# Altium schematic sheet PowerModule.SchDoc
size A3; SheetNumber: 1; SheetTotal: 8
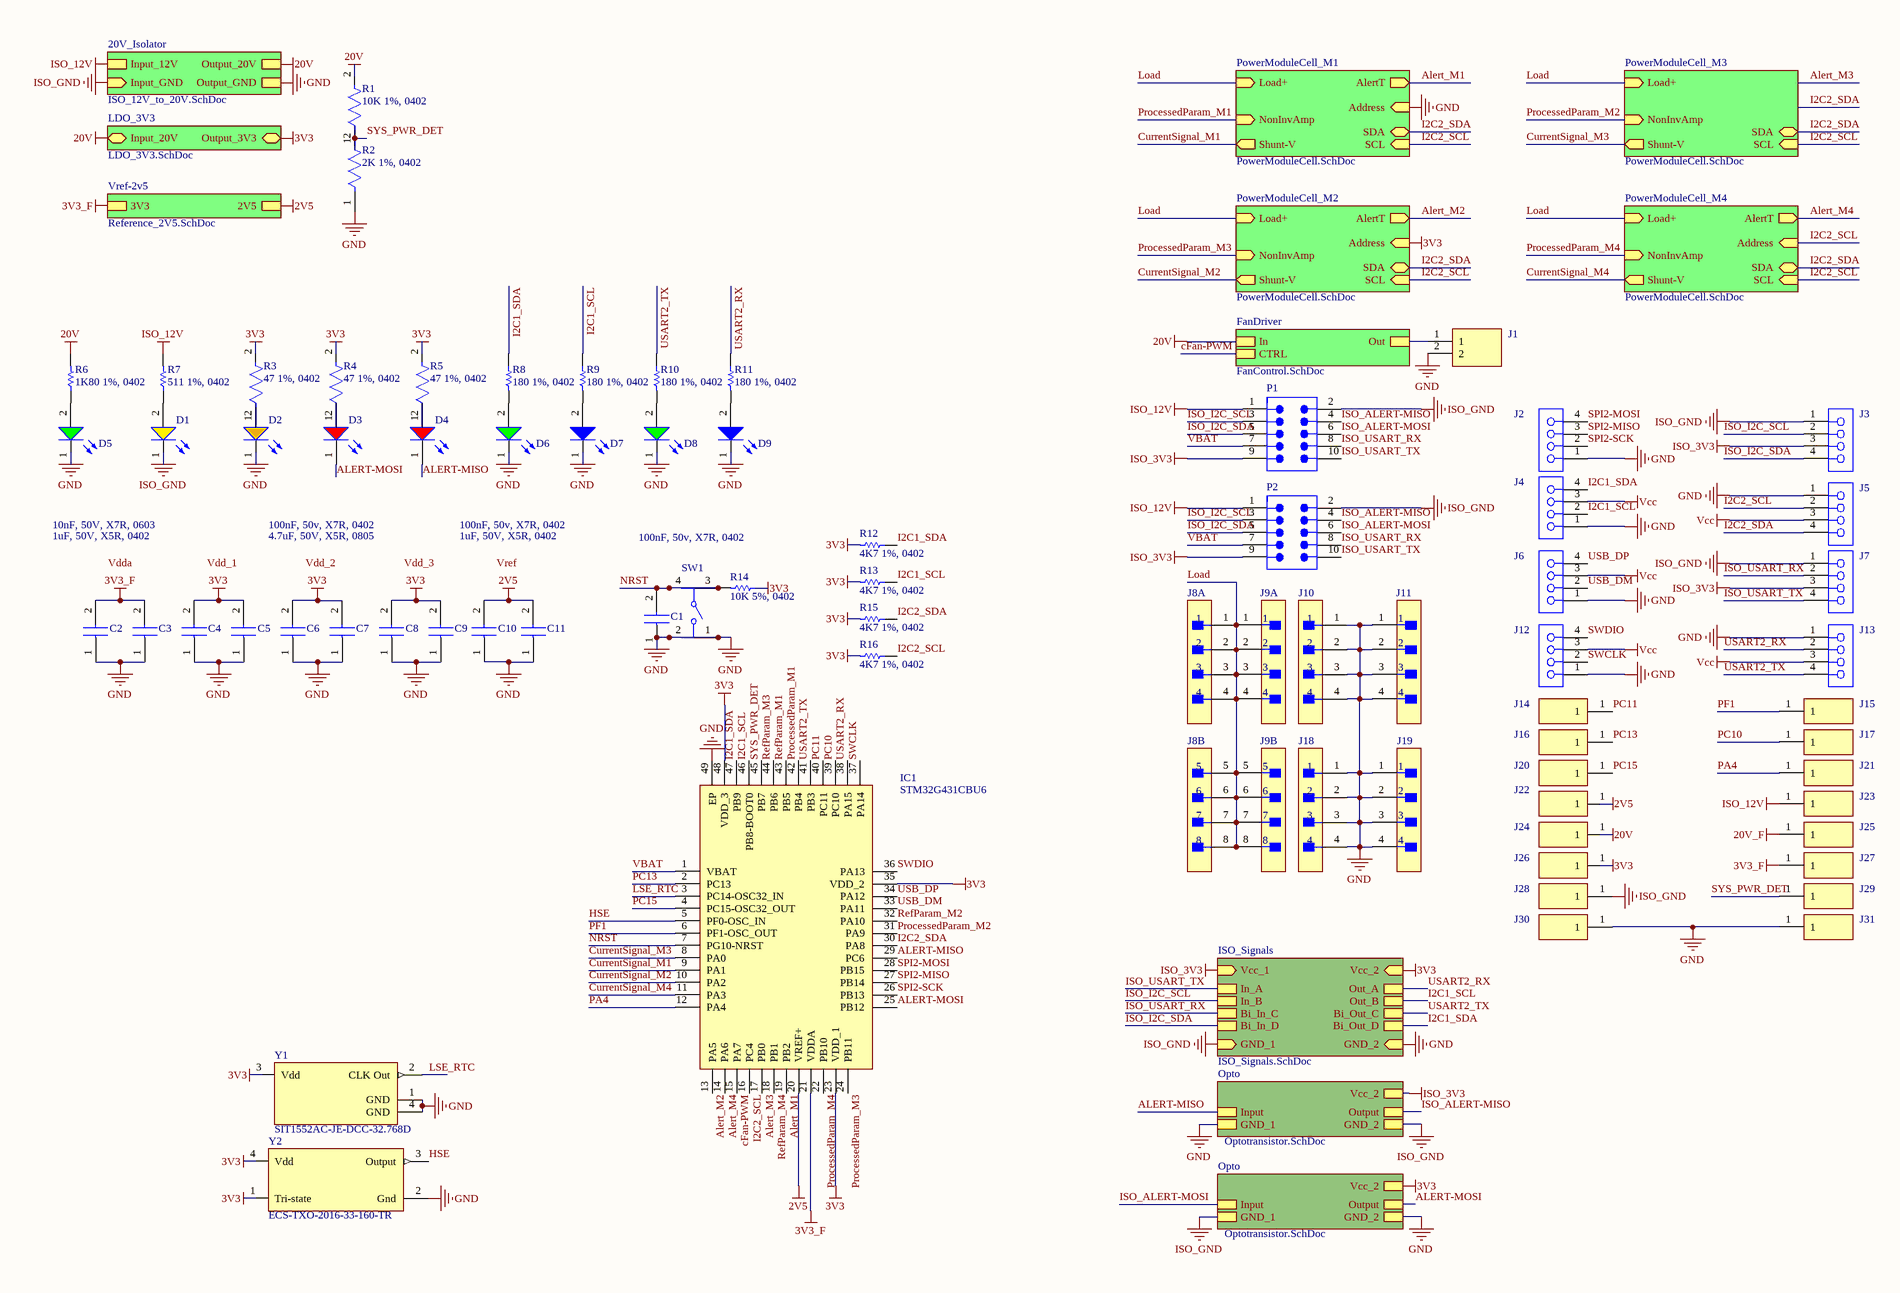
[diagram p0: PowerModule.SchDoc, left]
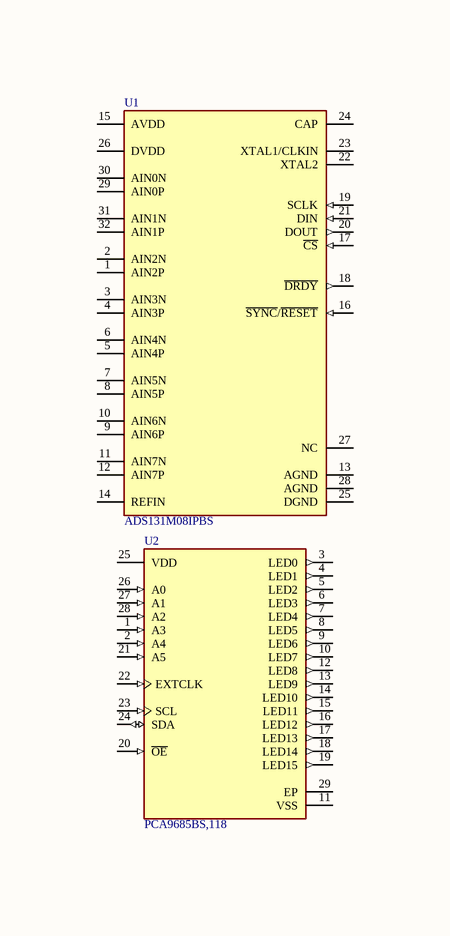
[diagram p1: PowerModule.SchDoc, middle]
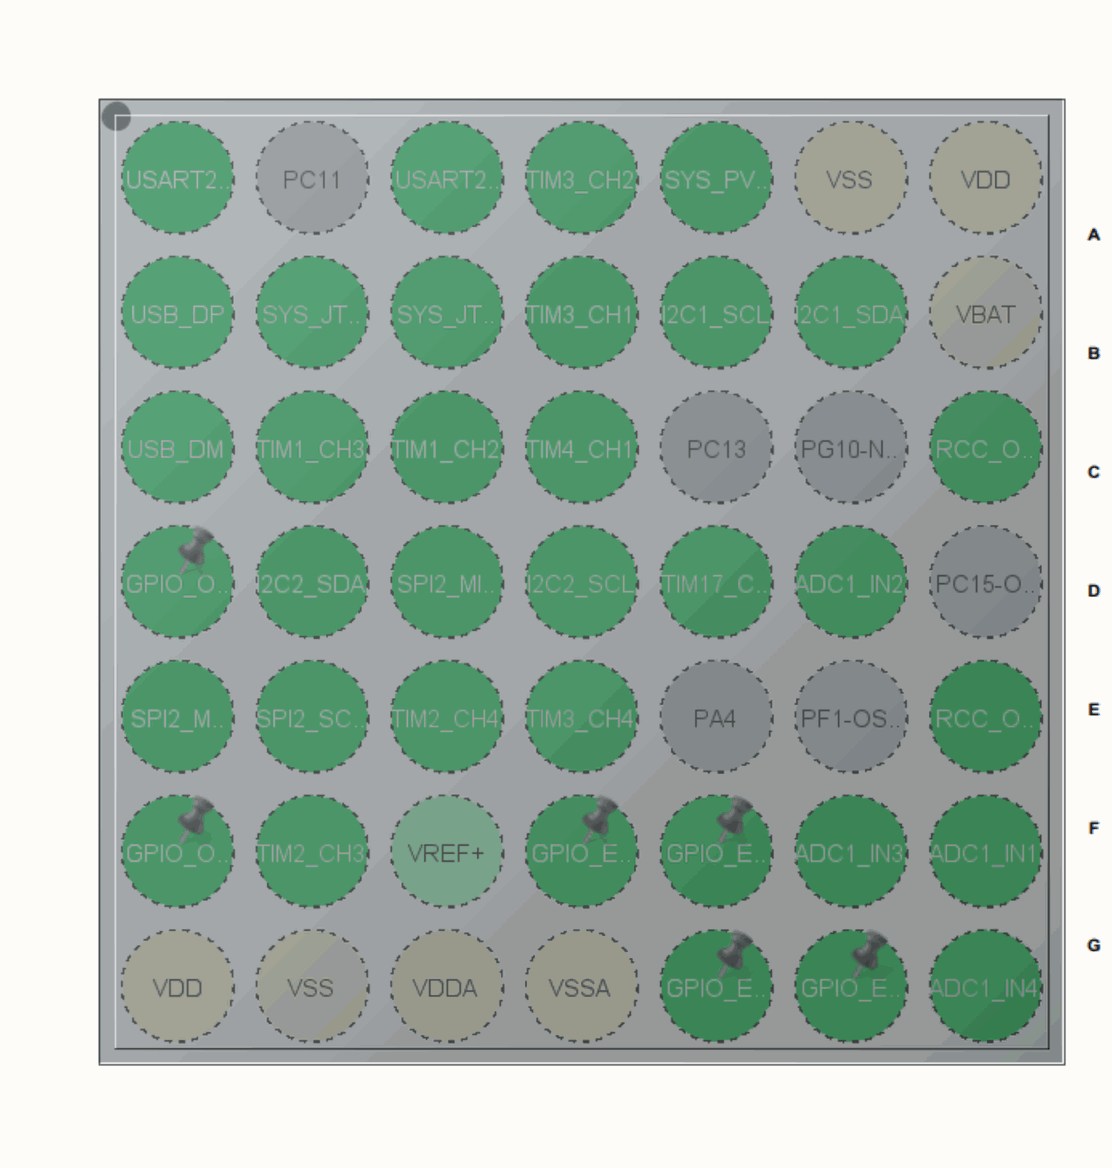
[diagram p2: PowerModule.SchDoc, right]

## Parts
C1  100nF, 50v, X7R, 0402  [CAPC2012X88N]  (value not drawn)
C2  10nF, 50V, X7R, 0603  [CAPC1608X87N]  (value not drawn)
C3  1uF, 50V, X5R, 0402  [GRM15x]  (value not drawn)
C4  100nF, 50v, X7R, 0402  [CAPC2012X88N]  (value not drawn)
C5  4.7uF, 50V, X5R, 0805  [CAPC2012X145N]  (value not drawn)
C6  100nF, 50v, X7R, 0402  [CAPC2012X88N]  (value not drawn)
C7  4.7uF, 50V, X5R, 0805  [CAPC2012X145N]  (value not drawn)
C8  100nF, 50v, X7R, 0402  [CAPC2012X88N]  (value not drawn)
C9  4.7uF, 50V, X5R, 0805  [CAPC2012X145N]  (value not drawn)
C10  100nF, 50v, X7R, 0402  [CAPC2012X88N]  (value not drawn)
C11  1uF, 50V, X5R, 0402  [GRM15x]  (value not drawn)
D1  150060YS75000  [WL-SMCW_0603_150060xx75000]  (value not drawn)
D2  150060AS75000  [WL-SMCW_0603_150060xx75000]  (value not drawn)
D3  150060RS75000  [WL-SMCW_0603_150060xx75000]  (value not drawn)
D4  150060RS75000  [WL-SMCW_0603_150060xx75000]  (value not drawn)
D5  150060GS75000  [WL-SMCW_0603_150060xx75000]  (value not drawn)
D6  150060GS75000  [WL-SMCW_0603_150060xx75000]  (value not drawn)
D7  150060BS75000  [WL-SMCW_0603_150060xx75000]  (value not drawn)
D8  150060GS75000  [WL-SMCW_0603_150060xx75000]  (value not drawn)
D9  150060BS75000  [WL-SMCW_0603_150060xx75000]  (value not drawn)
IC1  STM32G431CBU6  [QFN50P700X700X65-49N-D]
J1  1725656  [1725656]  (value not drawn)
J2  61300411821  [61300411821]  (value not drawn)  (net tie, no BOM)
J3  61300411821  [61300411821]  (value not drawn)  (net tie, no BOM)
J4  61300411821  [61300411821]  (value not drawn)  (net tie, no BOM)
J5  61300411821  [61300411821]  (value not drawn)  (net tie, no BOM)
J6  61300411821  [61300411821]  (value not drawn)  (net tie, no BOM)
J7  61300411821  [61300411821]  (value not drawn)  (net tie, no BOM)
J8  43045-0802  [FP-43045-0802-MFG]  (value not drawn)  (parts A,B of 2)
J9  43045-0802  [FP-43045-0802-MFG]  (value not drawn)  (parts A,B of 2)
J10  43045-0400  [FP-43045-0400-MFG]  (value not drawn)
J11  43045-0400  [FP-43045-0400-MFG]  (value not drawn)
J12  61300411821  [61300411821]  (value not drawn)  (net tie, no BOM)
J13  61300411821  [61300411821]  (value not drawn)  (net tie, no BOM)
J14  TestPad  [TestPad]  (value not drawn)  (no BOM)
J15  TestPad  [TestPad]  (value not drawn)  (no BOM)
J16  TestPad  [TestPad]  (value not drawn)  (no BOM)
J17  TestPad  [TestPad]  (value not drawn)  (no BOM)
J18  43045-0400  [FP-43045-0400-MFG]  (value not drawn)
J19  43045-0400  [FP-43045-0400-MFG]  (value not drawn)
J20  TestPad  [TestPad]  (value not drawn)  (no BOM)
J21  TestPad  [TestPad]  (value not drawn)  (no BOM)
J22  TestPad  [TestPad]  (value not drawn)  (no BOM)
J23  TestPad  [TestPad]  (value not drawn)  (no BOM)
J24  TestPad  [TestPad]  (value not drawn)  (no BOM)
J25  TestPad  [TestPad]  (value not drawn)  (no BOM)
J26  TestPad  [TestPad]  (value not drawn)  (no BOM)
J27  TestPad  [TestPad]  (value not drawn)  (no BOM)
J28  TestPad  [TestPad]  (value not drawn)  (no BOM)
J29  TestPad  [TestPad]  (value not drawn)  (no BOM)
J30  TestPad  [TestPad]  (value not drawn)  (no BOM)
J31  TestPad  [TestPad]  (value not drawn)  (no BOM)
P1  61201021621  [61201021621]  (value not drawn)
P2  61201021621  [61201021621]  (value not drawn)
R1  10K 1%, 0402  [FP-ERA2A-MFG]
R2  2K 1%, 0402  [FP-ERJ2RK-MFG]
R3  47 1%, 0402  [FP-ERJ2RK-IPC_C]
R4  47 1%, 0402  [FP-ERJ2RK-IPC_C]
R5  47 1%, 0402  [FP-ERJ2RK-IPC_C]
R6  1K80 1%, 0402  [RESC1005X40X25NL10T10]
R7  511 1%, 0402  [RESC1005X40X25ML05T05]
R8  180 1%, 0402  [RESC1005X40X25NL05T05]
R9  180 1%, 0402  [RESC1005X40X25NL05T05]
R10  180 1%, 0402  [RESC1005X40X25NL05T05]
R11  180 1%, 0402  [RESC1005X40X25NL05T05]
R12  4K7 1%, 0402  [RESC1005X40X25LL05T05]
R13  4K7 1%, 0402  [RESC1005X40X25LL05T05]
R14  10K 5%, 0402  [RESC1005X40X25ML05T05]
R15  4K7 1%, 0402  [RESC1005X40X25LL05T05]
R16  4K7 1%, 0402  [RESC1005X40X25LL05T05]
SW1  PTS810SJM250SMTRLFS  [FP-PTS810SJM250SMTRLFS-MFG]  (value not drawn)
U1  ADS131M08IPBS  [FP-PBS0032A-IPC_C]
U2  PCA9685BS,118  [FP-SOT788-1-IPC_B]
Y1  SIT1552AC-JE-DCC-32.768D  [FP-SiT1552-J-MFG]
Y2  ECS-TXO-2016-33-160-TR  [FP-TXO-2016-MFG]

## Sub-sheets
20V_Isolator = ISO_12V_to_20V.SchDoc: Output_20V, Output_GND, Input_12V, Input_GND (in)
FanDriver = FanControl.SchDoc: In, Out, CTRL
ISO_Signals = ISO_Signals.SchDoc: In_A, In_B, Bi_In_C, Bi_In_D, Vcc_1 (in), Vcc_2 (in), GND_1 (in), GND_2 (in), Out_A, Out_B, Bi_Out_C, Bi_Out_D
LDO_3V3 = LDO_3V3.SchDoc: Output_3V3 (bidir), Input_20V (bidir)
Opto = Optotransistor.SchDoc: Output, Input, GND_1, Vcc_2, GND_2
Opto = Optotransistor.SchDoc: Output, Input, GND_1, Vcc_2, GND_2
PowerModuleCell_M1 = PowerModuleCell.SchDoc: AlertT (out), Address (in), SDA (bidir), SCL (in), Load+ (in), NonInvAmp (in), Shunt-V (out)
PowerModuleCell_M2 = PowerModuleCell.SchDoc: AlertT (out), Address (in), SDA (bidir), SCL (in), Load+ (in), NonInvAmp (in), Shunt-V (out)
PowerModuleCell_M3 = PowerModuleCell.SchDoc: SDA (bidir), SCL (in), Load+ (in), NonInvAmp (in), Shunt-V (out)
PowerModuleCell_M4 = PowerModuleCell.SchDoc: AlertT (out), Address (in), SDA (bidir), SCL (in), Load+ (in), NonInvAmp (in), Shunt-V (out)
Vref-2v5 = Reference_2V5.SchDoc: 2V5, 3V3

## Nets
2V5: C10.2 C11.2 IC1.20(VREF+) J22.1 ; sheet Vref-2v5/2V5
3V3: C4.2 C5.2 C6.2 C7.2 C8.2 C9.2 IC1.23(VDD_1) IC1.35(VDD_2) IC1.48(VDD_3) J26.1 R3.2 R4.2 R5.2 R12.2 R13.2 R14.1 R15.2 R16.2 Y1.3(Vdd) Y2.1(Tri-state) Y2.4(Vdd) ; sheet PowerModuleCell_M2/Address, sheet LDO_3V3/Output_3V3, sheet Opto/Vcc_2, sheet ISO_Signals/Vcc_2
3V3_F: C2.2 C3.2 IC1.21(VDDA) J27.1 ; sheet Vref-2v5/3V3
20V: J24.1 R1.2 R6.2 ; sheet 20V_Isolator/Output_20V, sheet LDO_3V3/Input_20V, sheet FanDriver/In
20V_F: J25.1
GND: C1.1 C2.1 C3.1 C4.1 C5.1 C6.1 C7.1 C8.1 C9.1 C10.1 C11.1 D2.1(K) D5.1(K) D6.1(K) D7.1(K) D8.1(K) D9.1(K) IC1.49(EP) J1.2 J2.1 J4.1 J5.1 J6.1 J10.1 J10.2 J10.3 J10.4 J11.1 J11.2 J11.3 J11.4 J12.1 J13.1 J18.1 J18.2 J18.3 J18.4 J19.1 J19.2 J19.3 J19.4 J30.1 J31.1 R2.1 SW1.1 SW1.2 Y1.1(GND) Y1.4(GND) Y2.2(Gnd) ; sheet PowerModuleCell_M1/Address, sheet 20V_Isolator/Output_GND, sheet Opto/GND_1, sheet Opto/GND_2, sheet ISO_Signals/GND_2
ISO_3V3: J3.3 J7.3 P1.9 P2.9 ; sheet Opto/Vcc_2, sheet ISO_Signals/Vcc_1
ISO_12V: J23.1 P1.1 P2.1 R7.2 ; sheet 20V_Isolator/Input_12V
ISO_GND: D1.1(K) J3.1 J7.1 J28.1 P1.2 P2.2 ; sheet 20V_Isolator/Input_GND, sheet Opto/GND_2, sheet Opto/GND_1, sheet ISO_Signals/GND_1
Vcc: J4.3 J5.3 J6.3 J12.3 J13.3
ALERT-MISO: D4.1(K) IC1.29(PC6) ; sheet Opto/Input
ALERT-MOSI: D3.1(K) IC1.25(PB12) ; sheet Opto/Output
Alert_M1: IC1.19(PB2) ; sheet PowerModuleCell_M1/AlertT
Alert_M2: IC1.13(PA5) ; sheet PowerModuleCell_M2/AlertT
Alert_M3: IC1.17(PB0)
Alert_M4: IC1.14(PA6) ; sheet PowerModuleCell_M4/AlertT
cFan-PWM: IC1.15(PA7) ; sheet FanDriver/CTRL
CurrentSignal_M1: IC1.9(PA1) ; sheet PowerModuleCell_M1/Shunt-V
CurrentSignal_M2: IC1.10(PA2) ; sheet PowerModuleCell_M2/Shunt-V
CurrentSignal_M3: IC1.8(PA0) ; sheet PowerModuleCell_M3/Shunt-V
CurrentSignal_M4: IC1.11(PA3) ; sheet PowerModuleCell_M4/Shunt-V
HSE: IC1.5(PF0-OSC_IN) Y2.3(Output)
I2C1_SCL: IC1.46(PB8-BOOT0) J4.2 R9.1 R13.1 ; sheet ISO_Signals/Out_B
I2C1_SDA: IC1.47(PB9) J4.4 R8.1 R12.1 ; sheet ISO_Signals/Bi_Out_D
I2C2_SCL: IC1.16(PC4) J5.2 R16.1 ; sheet PowerModuleCell_M1/SCL, sheet PowerModuleCell_M2/SCL, sheet PowerModuleCell_M3/SCL, sheet PowerModuleCell_M4/Address, sheet PowerModuleCell_M4/SCL
I2C2_SDA: IC1.30(PA8) J5.4 R15.1 ; sheet PowerModuleCell_M1/SDA, sheet PowerModuleCell_M2/SDA, sheet PowerModuleCell_M3/SDA, sheet PowerModuleCell_M4/SDA
ISO_ALERT-MISO: P1.4 P2.4 ; sheet Opto/Output
ISO_ALERT-MOSI: P1.6 P2.6 ; sheet Opto/Input
ISO_I2C_SCL: J3.2 P1.3 P2.3 ; sheet ISO_Signals/In_B
ISO_I2C_SDA: J3.4 P1.5 P2.5 ; sheet ISO_Signals/Bi_In_D
ISO_USART_RX: J7.2 P1.8 P2.8 ; sheet ISO_Signals/Bi_In_C
ISO_USART_TX: J7.4 P1.10 P2.10 ; sheet ISO_Signals/In_A
Load: J8.1 J8.2 J8.3 J8.4 J8.5 J8.6 J8.7 J8.8 J9.1 J9.2 J9.3 J9.4 J9.5 J9.6 J9.7 J9.8 ; sheet PowerModuleCell_M1/Load+, sheet PowerModuleCell_M2/Load+, sheet PowerModuleCell_M3/Load+, sheet PowerModuleCell_M4/Load+
LSE_RTC: IC1.3(PC14-OSC32_IN) Y1.2(CLK_Out)
NRST: C1.2 IC1.7(PG10-NRST) R14.2 SW1.3 SW1.4
PA4: IC1.12(PA4) J21.1
PC10: IC1.39(PC10) J17.1
PC11: IC1.40(PC11) J14.1
PC13: IC1.2(PC13) J16.1
PC15: IC1.4(PC15-OSC32_OUT) J20.1
PF1: IC1.6(PF1-OSC_OUT) J15.1
ProcessedParam_M1: IC1.42(PB4) ; sheet PowerModuleCell_M1/NonInvAmp
ProcessedParam_M2: IC1.31(PA9) ; sheet PowerModuleCell_M3/NonInvAmp
ProcessedParam_M3: IC1.24(PB11) ; sheet PowerModuleCell_M2/NonInvAmp
ProcessedParam_M4: IC1.22(PB10) ; sheet PowerModuleCell_M4/NonInvAmp
RefParam_M1: IC1.43(PB5)
RefParam_M2: IC1.32(PA10)
RefParam_M3: IC1.44(PB6)
RefParam_M4: IC1.18(PB1)
SPI2-MISO: IC1.27(PB14) J2.3
SPI2-MOSI: IC1.28(PB15) J2.4
SPI2-SCK: IC1.26(PB13) J2.2
SWCLK: IC1.37(PA14) J12.2
SWDIO: IC1.36(PA13) J12.4
SYS_PWR_DET: IC1.45(PB7) J29.1 R1.1 R2.2
USART2_RX: IC1.38(PA15) J13.2 R11.1 ; sheet ISO_Signals/Out_A
USART2_TX: IC1.41(PB3) J13.4 R10.1 ; sheet ISO_Signals/Bi_Out_C
USB_DM: IC1.33(PA11) J6.2
USB_DP: IC1.34(PA12) J6.4
VBAT: IC1.1(VBAT) P1.7 P2.7
NetD1_2: D1.2(A) R7.1
NetD2_2: D2.2(A) R3.1
NetD3_2: D3.2(A) R4.1
NetD4_2: D4.2(A) R5.1
NetD5_2: D5.2(A) R6.1
NetD6_2: D6.2(A) R8.2
NetD7_2: D7.2(A) R9.2
NetD8_2: D8.2(A) R10.2
NetD9_2: D9.2(A) R11.2
NetJ1_1: J1.1 ; sheet FanDriver/Out

Not connected (* = marked no-connect by the designer): U1 1(AIN2P) 2(AIN2N) 3(AIN3N) 4(AIN3P) 5(AIN4P) 6(AIN4N) 7(AIN5N) 8(AIN5P) 9(AIN6P) 10(AIN6N) 11(AIN7N) 12(AIN7P) 13(AGND) 14(REFIN) 15(AVDD) 16(~{SYNC}/~{RESET}) 17(~{CS}) 18(~{DRDY}) 19(SCLK) 20(DOUT) 21(DIN) 22(XTAL2) 23(XTAL1/CLKIN) 24(CAP) 25(DGND) 26(DVDD) 27(NC) 28(AGND) 29(AIN0P) 30(AIN0N) 31(AIN1N) 32(AIN1P); U2 1(A3) 2(A4) 3(LED0) 4(LED1) 5(LED2) 6(LED3) 7(LED4) 8(LED5) 9(LED6) 10(LED7) 11(VSS) 12(LED8) 13(LED9) 14(LED10) 15(LED11) 16(LED12) 17(LED13) 18(LED14) 19(LED15) 20(~{OE}) 21(A5) 22(EXTCLK) 23(SCL) 24(SDA) 25(VDD) 26(A0) 27(A1) 28(A2) 29(EP)

## Notes on the sheet
- 1uF, 50V, X5R, 0402
- 10nF, 50V, X7R, 0603
- 4.7uF, 50V, X5R, 0805
- 100nF, 50v, X7R, 0402
- Vdda
- Vdd_1
- Vdd_2
- Vdd_3
- Vref

## Library data of the parts
C1 C4 C6 C8 C10 = C0805C104M5RAC: Capacitor; Manufacturer_Name: KEMET; Datasheet Link: https://connect.kemet.com:7667/gateway/IntelliData-ComponentDocumentation/1.0/download/specsheet/C0805C104M5RAC%7bBULK%7d; Height: 0.88mm; Manufacturer_Part_Number: C0805C104M5RAC; Mouser Part Number: 80-C0805C104M5RAC; Mouser Price/Stock: https://www.mouser.co.uk/ProductDetail/KEMET/C0805C104M5RAC?qs=VOOUd%252Bza08rWzt4y8eXMuQ%3D%3D; Arrow Part Number: C0805C104M5RAC; Arrow Price/Stock: https://www.arrow.com/en/products/c0805c104m5rac/kemet-corporation?utm_currency=USD&region=nac
C2 = C0603C103J5RAC: Capacitor; Manufacturer_Name: KEMET; Datasheet Link: https://www.kemet.com/specsheet/C0603C103J5RAC%7BBULK%7D; Height: 0.87mm; Manufacturer_Part_Number: C0603C103J5RAC; Mouser Part Number: 80-C0603C103J5RAC; Mouser Price/Stock: https://www.mouser.co.uk/ProductDetail/KEMET/C0603C103J5RAC?qs=Zjfhvh7dXTOjKlZBdCXdvg%3D%3D; Arrow Part Number: C0603C103J5RAC; Arrow Price/Stock: https://www.arrow.com/en/products/c0603c103j5rac/kemet-corporation?region=nac
C3 C11 = GRM155R61H105KE05J: Capacitor; Manufacturer_Name: Murata Electronics; Datasheet Link: https://search.murata.co.jp/Ceramy/image/img/A01X/G101/ENG/GRM155R61H105KE05-01A.pdf; Height: 0.33mm; Manufacturer_Part_Number: GRM155R61H105KE05J; Mouser Part Number: 81-GRM155R61H105KE5J; Mouser Price/Stock: https://www.mouser.co.uk/ProductDetail/Murata-Electronics/GRM155R61H105KE05J?qs=d0WKAl%252BL4KZilUxqJ3m7lA%3D%3D; Arrow Part Number: GRM155R61H105KE05J; Arrow Price/Stock: https://www.arrow.com/en/products/grm155r61h105ke05j/murata-manufacturing?region=nac
C5 C7 C9 = GRM21BR61H475ME51L: Capacitor; Manufacturer_Name: Murata Electronics; Datasheet Link: https://search.murata.co.jp/Ceramy/image/img/A01X/G101/ENG/GRM21BR61H475ME51-01A.pdf; Height: 1.45mm; Manufacturer_Part_Number: GRM21BR61H475ME51L; Mouser Part Number: 81-GRM21BR61H475M51L; Mouser Price/Stock: https://www.mouser.co.uk/ProductDetail/Murata-Electronics/GRM21BR61H475ME51L?qs=eeBpzGFlv%252B%2Fg0wAeHy0eJw%3D%3D; Arrow Part Number: GRM21BR61H475ME51L; Arrow Price/Stock: https://www.arrow.com/en/products/grm21br61h475me51l/murata-manufacturing?region=nac
D1 = CMP-1426-00005-3: WL-SMCW SMT Mono-Color Chip LED Waterclear; Power Dissipation: 72mW; Reverse Voltage: 5V; Forward Voltage: 2V; Test Current: 20mA; Luminous Intensity: 120mcd; Max Junction Temperature (Tj): 95°C; Wavelength: 590nm; Color: Yellow; Forward Current: 100mA; Lens Style: Clear, Rectangular; Viewing Angle: 140°; Peak Wavelength: 595nm; Case Code (Metric): 1608; Length: 1.6mm; Max Reverse Voltage (DC): 5V; Case Code (Imperial): 0603; Dominant Wavelength: 590nm; Mount: Surface Mount; Max Operating Temperature: 85°C; Min Operating Temperature: -40°C; Packaging: Tape and Reel; REACH SVHC: Unknown; Width: 800µm; Case/Package: 0603; Height: 700µm; RoHS: Compliant
D2 = CMP-03913-89970694-2: WL-SMCW SMT Mono-Color Chip LED Waterclear; Luminous Intensity: 130mcd; Max Reverse Voltage (DC): 5V; Viewing Angle: 140°; Dominant Wavelength: 605nm; Forward Current: 100mA; Forward Voltage: 2V; Peak Wavelength: 610nm; RoHS: Compliant; Min Operating Temperature: -40°C; Wavelength: 605nm; Max Operating Temperature: 85°C; Packaging: Tape and Reel
D3 D4 = CMP-1426-00001-4: LED Low-Power Uni-Color Red 630nm 2V 2-Pin Chip 0603(1608Metric) T/R; Max Junction Temperature (Tj): 95°C; Dominant Wavelength: 625nm; Lens Style: Clear, Rectangular; Viewing Angle: 140°; Forward Current: 100mA; Max Reverse Voltage (DC): 5V; Luminous Intensity: 250mcd; Test Current: 20mA; Power Dissipation: 72mW; Max Operating Temperature: 85°C; Mount: Surface Mount; Height: 700µm; Packaging: Tape and Reel; REACH SVHC: Unknown; Case Code (Metric): 1608; Peak Wavelength: 630nm; Forward Voltage: 2V; Case/Package: 0603; Color: Red; RoHS: Compliant; Width: 800µm; Reverse Voltage: 5V; Min Operating Temperature: -40°C; Wavelength: 625nm; Case Code (Imperial): 0603; Length: 1.6mm
D5 D6 D8 = CMP-1426-00002-4: 430mcd Colorless transparence 520nm Emerald 140° LED0603 Light Emitting Diodes (LED) ROHS; Peak Wavelength: 515nm; Forward Current: 100mA; Reverse Voltage: 5V; Output Current: 10µA; Power Dissipation: 105mW; Lens Style: Clear, Rectangular; Dominant Wavelength: 525nm; Color: Green; Test Current: 20mA; Max Junction Temperature (Tj): 95°C; Forward Voltage: 3.2V; Width: 800µm; Max Operating Temperature: 85°C; Case Code (Metric): 1608; Luminous Intensity: 430mcd; Lead Free: Lead Free; Case/Package: 0603; Case Code (Imperial): 0603; Mount: Surface Mount; Max Reverse Voltage (DC): 5V; Packaging: Tape and Reel; RoHS: Compliant; Viewing Angle: 140°; REACH SVHC: Unknown; Min Operating Temperature: -40°C; Height: 700µm; Wavelength: 525nm; Length: 1.6mm
D7 D9 = CMP-1426-00003-4: Led, Blue, 470 Nm, 3.2 V, 30 Ma, 145 Mcd Rohs Compliant: Yes; Peak Wavelength: 465nm; Dominant Wavelength: 470nm; Power Dissipation: 105mW; Viewing Angle: 140°; Test Current: 20mA; Max Junction Temperature (Tj): 95°C; Forward Current: 100mA; Reverse Voltage: 5V; Luminous Intensity: 145mcd; Lens Style: Clear, Rectangular; Forward Voltage: 3.2V; RoHS: Compliant; Min Operating Temperature: -40°C; REACH SVHC: Unknown; Max Operating Temperature: 85°C; Width: 800µm; Case Code (Imperial): 0603; Case Code (Metric): 1608; Max Reverse Voltage (DC): 5V; Height: 700µm; Case/Package: 0603; Mount: Surface Mount; Packaging: Tape and Reel; Color: Blue; Wavelength: 470nm; Length: 1.6mm
IC1 = STM32G431CBU6: Integrated Circuit; Manufacturer_Name: STMicroelectronics; Datasheet Link: https://www.st.com/resource/en/datasheet/stm32g431cb.pdf; Height: 0.65mm; Manufacturer_Part_Number: STM32G431CBU6; Mouser Part Number: 511-STM32G431CBU6; Mouser Price/Stock: https://www.mouser.co.uk/ProductDetail/STMicroelectronics/STM32G431CBU6?qs=T3oQrply3y%252B0hTuSHQ7oqA%3D%3D; Arrow Part Number: STM32G431CBU6; Arrow Price/Stock: https://www.arrow.com/en/products/stm32g431cbu6/stmicroelectronics?utm_currency=USD&region=nac
J1 = 1725656: Connector; Manufacturer_Name: Phoenix Contact; Datasheet Link: https://www.phoenixcontact.com/online/portal/us/?uri=pxc-oc-itemdetail:pid=1725656&library=usen&pcck=P-11-01-05&tab=1&selectedCategory=ALL; Height: 8.65mm; Manufacturer_Part_Number: 1725656; Mouser Part Number: 651-1725656; Mouser Price/Stock: https://www.mouser.co.uk/ProductDetail/Phoenix-Contact/1725656?qs=Ul7CXFMnlWWQeccayYbRmw%3D%3D; Arrow Part Number: 1725656; Arrow Price/Stock: https://www.arrow.com/en/products/1725656/phoenix-contact?utm_currency=USD&region=nac
J2-J7 J12 J13 = CMP-1502-01316-3: NexarPartId: 61924712; Contact Resistance: 20mΩ; Gender: Female; Current Rating: 3A; Operating Supply Voltage: 250V; RoHS: Non-Compliant; Number of Pins: 4; Orientation: Vertical; Lead Pitch: 2.54mm
J8 J9 = CMP-04776-000999-1: CONN HEADER R/A 8POS 3MM; Current Rating: 5A; Insulation Resistance: 1GR; Max Voltage Rating (DC): 250.25kV; Number of Circuits: 8; Contact Resistance: 10mR; Voltage Rating: 250V; Gender: Male; Glow Wire Compliant: Compliant; Connector Type: Plug; Case/Package: 0802; Contact Material: Brass; Max Operating Temperature: 105°C; Color: Black; Housing Material: Thermoplastic; Depth: 12.2mm; Packaging: Tray; Length: 16.15mm; Series: Micro-Fit 3.0; Lead Free: Lead Free; Number of Contacts: 8; Pitch: 3mm; Contact Plating: Gold; Diameter: 3mm; Halogen Free: Low Halogen; Row Spacing: 3mm; Max Current Rating: 5A; Min Operating Temperature: -40°C; Height: 8.77mm; Radiation Hardening: No; Orientation: Right Angle; RoHS Compliant: Yes; Number of Positions: 8; Package Quantity: 1440; Termination: Solder; Mount: Through Hole; Voltage Rating (DC): 250V; Reach SVHC Compliant: Yes; Number of Rows: 2; Housing Color: Black; Flammability Rating: UL94 V-0
J10 J11 J18 J19 = CMP-04776-000002-1: CONN HEADER R/A 4POS 3MM; Manufacturer: Molex; Conn Gender: Male; Conn Orientation: Right Angle; Voltage Rating: 600V; Number Of Contacts: 4; Is Female: yes; Current Rating: 8.5A; ComponentLink2URL: https://www.molex.com/webdocs/datasheets/pdf/en-us/0430450400_PCB_HEADERS.pdf; Manufacturer Part Number: 43045-0400; Digikey Description: CONN HEADER R/A 4POS 3MM; Category: Conn; Temperature Range High: +105°C; Lead Free: Yes; Device Class L1: Connectors; Automotive: No; Temperature: -40°C to +105°C; Footprint Url: https://www.molex.com/pdm_docs/sd/430450400_sd.pdf; Height: 9.27mm; Number Of Rows: 2; Device Class L3: unset; Pitch: 3mm; Temperature Range Low: -40°C; Contact Material: Tin,Nickel; Octopart: https://octopart.com/43045-0400-molex-287063; RoHS: TRUE; ComponentLink2Description: Datasheet; Package: 43045-0400; Device Class L2: Headers and Wire Housings
J14-J17 J20-J31 = 61300111121: Connector; Manufacturer_Name: Wurth Elektronik; Datasheet Link: https://katalog.we-online.de/em/datasheet/6130xx11121.pdf; Height: 8.89mm; Manufacturer_Part_Number: 61300111121; Mouser Part Number: 710-61300111121; Mouser Price/Stock: https://www.mouser.co.uk/ProductDetail/Wurth-Elektronik/61300111121?qs=PhR8RmCirEaRH5Ck%252B2lRLQ%3D%3D
P1 P2 = CMP-1502-00007-2: NexarPartId: 8917783; Number of Contacts: 10; Voltage Rating (DC): 250V; Insulation Resistance: 1GΩ; Current Rating: 3A; Row Spacing: 2.54mm; Contact Resistance: 20mΩ; Connector Type: Male Pin; Gender: Male; Flammability Rating: UL94 V-0; Termination: Solder; Width: 20.36mm; Length: 20.36mm; Housing Material: PBT; Operating Supply Voltage: 250V; Min Operating Temperature: -40°C; Lead Free: Lead Free; Insulation Material: PBT; Orientation: Vertical; RoHS: Compliant; Voltage Rating: 250V; Number of Pins: 10; Height: 8.85mm; REACH SVHC: Unknown; Contact Material: Copper; Contact Gender: Male; Color: Black; Mount: Through Hole; Contact Plating: Gold; Lead Pitch: 2.54mm; Number of Positions: 10; Pitch: 2.54mm; Max Operating Temperature: 105°C; Number of Rows: 2
R1 = CMP-2002-05875-2: RES SMD 10K OHM 0.1% 1/16W 0402; Manufacturer Part Number: ERA-2AEB103X; Manufacturer: Panasonic; Temperature Coefficient: 25ppm/°C; Automotive Grade: Grade 0; Resistance: 10kΩ; Power Rating: 0.063W; Voltage Rating: 50V; Value: 10kΩ; RoHS: TRUE; Device Class L3: Chip SMD Resistors; Automotive: Yes; Series: ERA; Height: 0.4mm; Package: ERA2A; Temperature Range Low: -55°C; ComponentLink2Description: Datasheet; Tolerance: 0.1%; Device Class L2: Resistors; Temperature Range High: +155°C; Device Class L1: Passive Components; Digikey Description: RES SMD 10K OHM 0.1% 1/16W 0402; Category: Res; Mouser Description: Thin Film Resistors - SMD 0402 1/16W 10Kohms; Lead Free: Yes; Footprint Url: https://industrial.panasonic.com/cdbs/www-data/pdf/RDM0000/DMM0000COL17.pdf; Composition: Metal Film; Octopart: https://octopart.com/era-2aeb103x-panasonic-9251377; ComponentLink2URL: https://industrial.panasonic.com/cdbs/www-data/pdf/RDM0000/AOA0000C307.pdf; Temperature: -55°C to +155°C
R2 = CMP-2002-00758-4: RES SMD 2K OHM 1% 1/10W 0402; Temperature Coefficient: 100ppm/°C; Max Power Dissipation: 100mW; Working Voltage: 50V; Resistance: 2kR; Number of Terminations: 2; Technology: THICK FILM; Packaging: Tape and Reel; RoHS Compliant: Yes; Min Operating Temperature: -55°C; Length: 1mm; Construction: Rectangular; Features: Automotive AEC-Q200; Contact Plating: Tin; Lead Free: Lead Free; Series: ERJ; Power Rating: 100mW; REACH SVHC: No SVHC; Resistor Type: Thick Film; Max Operating Temperature: 155°C; Package Quantity: 10000; Height: 0.35mm; Case/Package: 0402; Tolerance: 1%; Mount: Surface Mount; Termination: SMD/SMT; Resistance Tolerance: 1%; Depth: 0.5mm; Voltage Rating (DC): 50V; Voltage Rating: 50V; Case Code (Imperial): 0402; Military Standard: Not; Width: 0.02inch; Radiation Hardening: No; Case Code (Metric): 1005
R3-R5 = CMP-1011-00360-3: RES SMD 47 OHM 1% 1/10W 0402; Resistance: 47R; Power Rating: 100mW; Temperature Coefficient: 100ppm/°C; Voltage Rating (DC): 50V; Case Code (Imperial): 0402; Width: 0.02inch; Height: 0.35mm; Features: Automotive AEC-Q200; Case/Package: 0402; RoHS Compliant: Yes; Lead Free: Lead Free; Case Code (Metric): 1005; Technology: THICK FILM; Termination: SMD/SMT; Tolerance: 1%; Resistance Tolerance: 1%; Max Operating Temperature: 155°C; Construction: Rectangular; Mount: Surface Mount; Min Operating Temperature: -55°C; Max Power Dissipation: 100mW; Number of Terminations: 2; Military Standard: Not; REACH SVHC: No SVHC; Resistor Type: Thick Film; Contact Plating: Tin; Package Quantity: 1; Series: ERJ; Packaging: Tape and Reel; Voltage Rating: 50V; Weight: 2.8E-05oz; Length: 1mm; Number of Pins: 2; Depth: 0.5mm
R6 = CMP-2002-05845-1: Part Number: ERA-2AED182X; Manufacturer: Panasonic
R7 = CMP-2002-00976-1: Part Number: ERJ-2RKF5113X; Manufacturer: Panasonic
R8-R11 = CMP-2002-01127-1: Manufacturer: Panasonic; Part Number: ERJ2RKF1800X
R12 R13 R15 R16 = CMP-2002-01154-4: Chip Resistor, 4.7 KOhm, +/- 1%, 0.1 W, -55 to 155 degC, 0402 (1005 Metric), RoHS, Tape and Reel; PartNumber: ERJ-2RKF4701X; Voltage Rating: 50 V; Case\/Package: 0402; Power Rating: 100 mW; Height: 0.35 mm; Mounting Technology: Surface Mount; REACH SVHC: Yes; Resistance: 4.7 KOhm; Max Operating Temperature: 155 degC; ComponentLink1Description: Manufacturer URL; ComponentLink2Description: Datasheet; Pins: 2; PackageReference: 0402; Tolerance: 1%; Case Code (Imperial): 0402; Length: 1 mm; PackageDescription: 2-Pin Surface Mount Device, Body 1 x 0.5 mm; RoHSCompliant: true; Package Quantity: 1; Radiation Hardening: No; DatasheetVersion: 04/2015; Width: 0.5 mm; Case Code (Metric): 1005; Mount: Surface Mount; ComponentLink1URL: http://www.panasonic.com/; Min Operating Temperature: -55 degC; Packaging: Cut Tape; ComponentLink2URL: http://industrial.panasonic.com/cdbs/www-data/pdf/RDA0000/AOA0000C86.pdf
R14 = CMP-2002-00433-1: Part Number: ERJ-2GEJ103X; Manufacturer: Panasonic
SW1 = CMP-10040-000001-2: SWITCH TACTILE SPST-NO 0.05A 16V; Throw Configuration: SPST; Operating Force: 160gf; Actuator Type: Standard; Switch Travel: 0.15mm; Switch Function: Off-Mom; Max Current Rating: 50mA; Mechanical Life: 150000Cycles; Illumination Type: Non-Illuminated; Package Quantity: 2900; Depth: 4.6mm; Mount: Surface Mount; Packaging: Tape and Reel; Length: 3.2mm; RoHS Compliant: Yes; Case/Package: SMD/SMT; Voltage Rating (DC): 16V; Min Operating Temperature: -40°C; Termination: J-Bend; Lead Free: Lead Free; Contact Plating: Silver; Orientation: Straight; Max Operating Temperature: 85°C; Current Rating: 50mA; Color: Black
U1 = CMP-04860-000022-1: 8 CHANNEL 24 BIT SIMULTANEOUS SA
U2 = CMP-1595-00001-4: IC LED DRVR LIN DIM 25MA 28HVQFN; Number of Outputs: 16; Output Voltage: 5.5V; Frequency: 50MHz; Min Operating Temperature: -40°C; Package Quantity: 4000; Case/Package: VQFN; Number of Pins: 28; Contact Plating: Gold; Radiation Hardening: No; RoHS Compliant: Yes; Packaging: Tape and Reel; Mount: Surface Mount; Max Operating Temperature: 85°C
Y1 = CMP-25159-260295-1: MEMS OSC TCXO 32.7680KHZ LVCMOS; Frequency Stability: 5ppm; Frequency: 32.768kHz; Min Operating Temperature: 0°C; Length: 0.061inch; Mount: Surface Mount; Max Operating Temperature: 70°C; Width: 0.033inch; RoHS Compliant: Yes; Series: SiT1552; Packaging: Cut Tape; Height: 0.024inch
Y2 = CMP-40224-000008-1: XTAL OSC TCXO 16MHZ 3.3V SMD; Manufacturer: ECS; Max Supply Voltage: 3.63V; Max Supply Current: 7mA; Stability: 2ppm; Min Supply Voltage: 2.97V; Load Capacitance: 15pF; Frequency: 16MHz; Device Class L1: Passive Components; Manufacturer Part Number: ECS-TXO-2016-33-160-TR; Digikey Description: XTAL OSC TCXO 16MHZ 3.3V SMD; Device Class L3: Oscillators; Category: Crys; Lead Free: Yes; Temperature: -40°C to +85°C; RoHS: TRUE; ComponentLink2Description: Datasheet; Octopart: https://octopart.com/ecs-txo-2016-33-160-tr-ecs+international-102811109; ComponentLink2URL: https://ecsxtal.com/store/pdf/ECS-TXO-2016.pdf; Temperature Range High: +85°C; Height: 0.8mm; Device Class L2: Crystals / Oscillators; Package: TXO-2016; Temperature Range Low: -40°C; Series: TXO-2016; Automotive: No